# Altium schematic sheet BLOCK_DIAGRAM.SchDoc
size A3; SheetNumber: 1; SheetTotal: 1
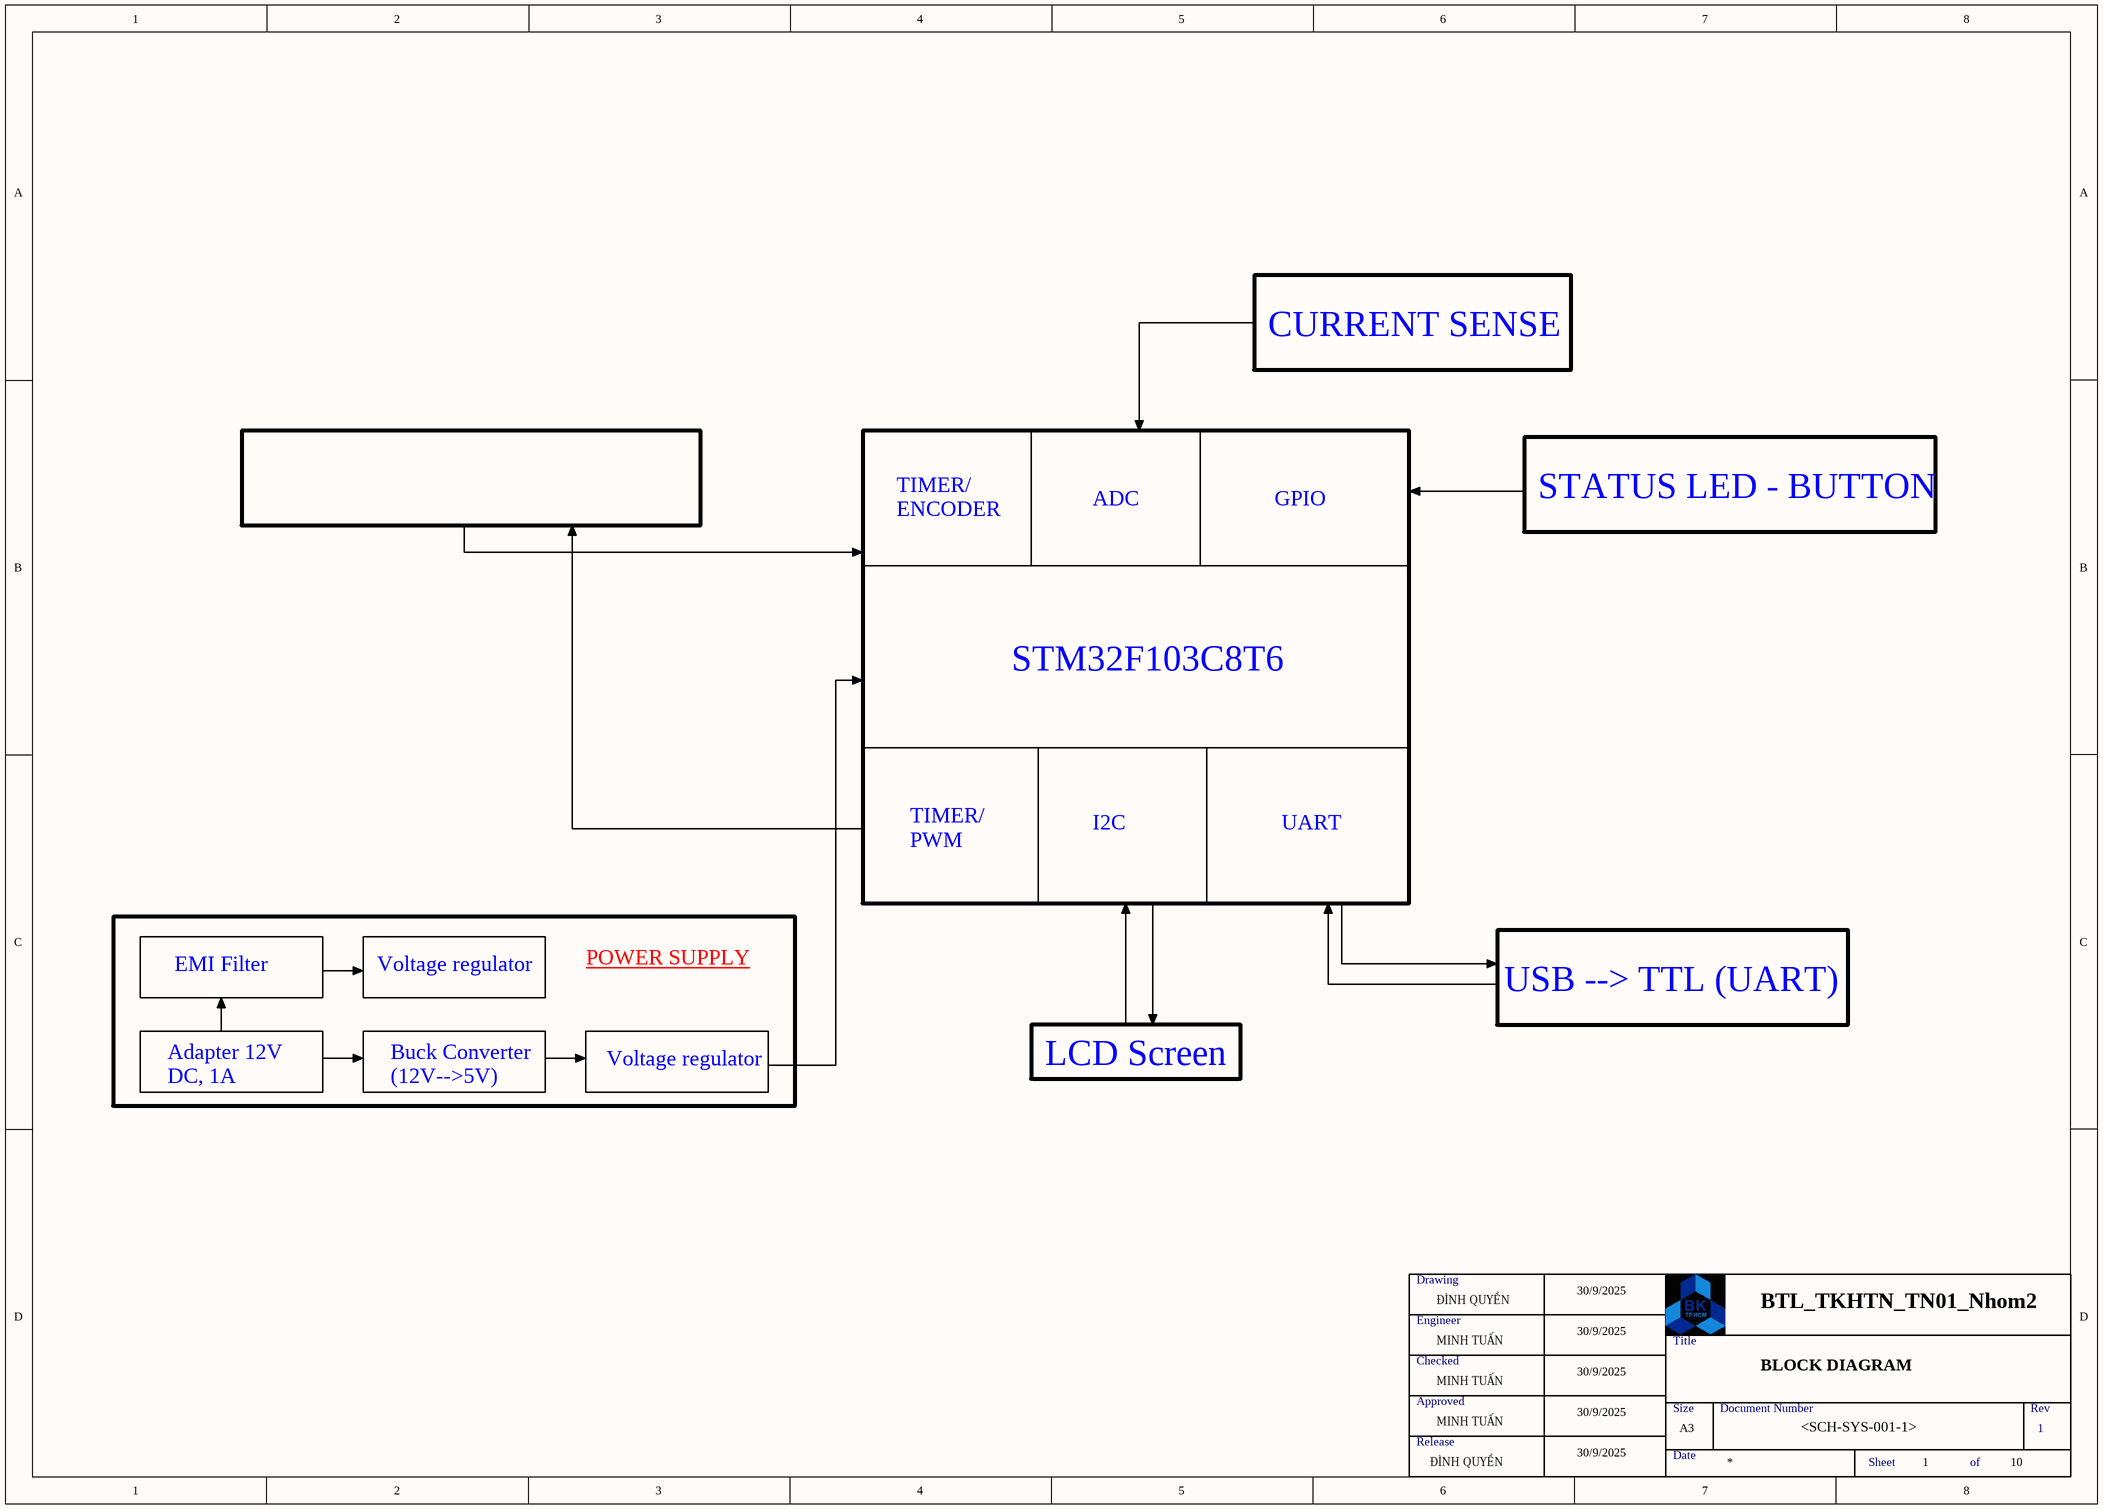
[diagram p0: BLOCK_DIAGRAM.SchDoc]

## Notes on the sheet
- CURRENT SENSE
- MOTOR + ENCODER
- TIMER/
  ENCODER
- ADC
- GPIO
- STATUS LED - BUTTON
- STM32F103C8T6
- TIMER/
  PWM
- I2C
- UART
- Voltage regulator
- POWER SUPPLY
- EMI Filter
- USB --> TTL (UART)
- Adapter 12V DC, 1A
- Buck Converter (12V-->5V)
- LCD Screen
- Drawing
- Engineer
- ĐÌNH QUYỀN
- 30/9/2025
- BTL_TKHTN_TN01_Nhom2
- Checked
- MINH TUẤN
- Title
- BLOCK DIAGRAM
- Approved
- Release
- Size
- Date
- A3
- Document Number
- <SCH-SYS-001-1>
- Rev
- 1
- Sheet
- of
- 10